# Altium schematic sheet [02] - TRICOLOR LEDS.SchDoc
size A
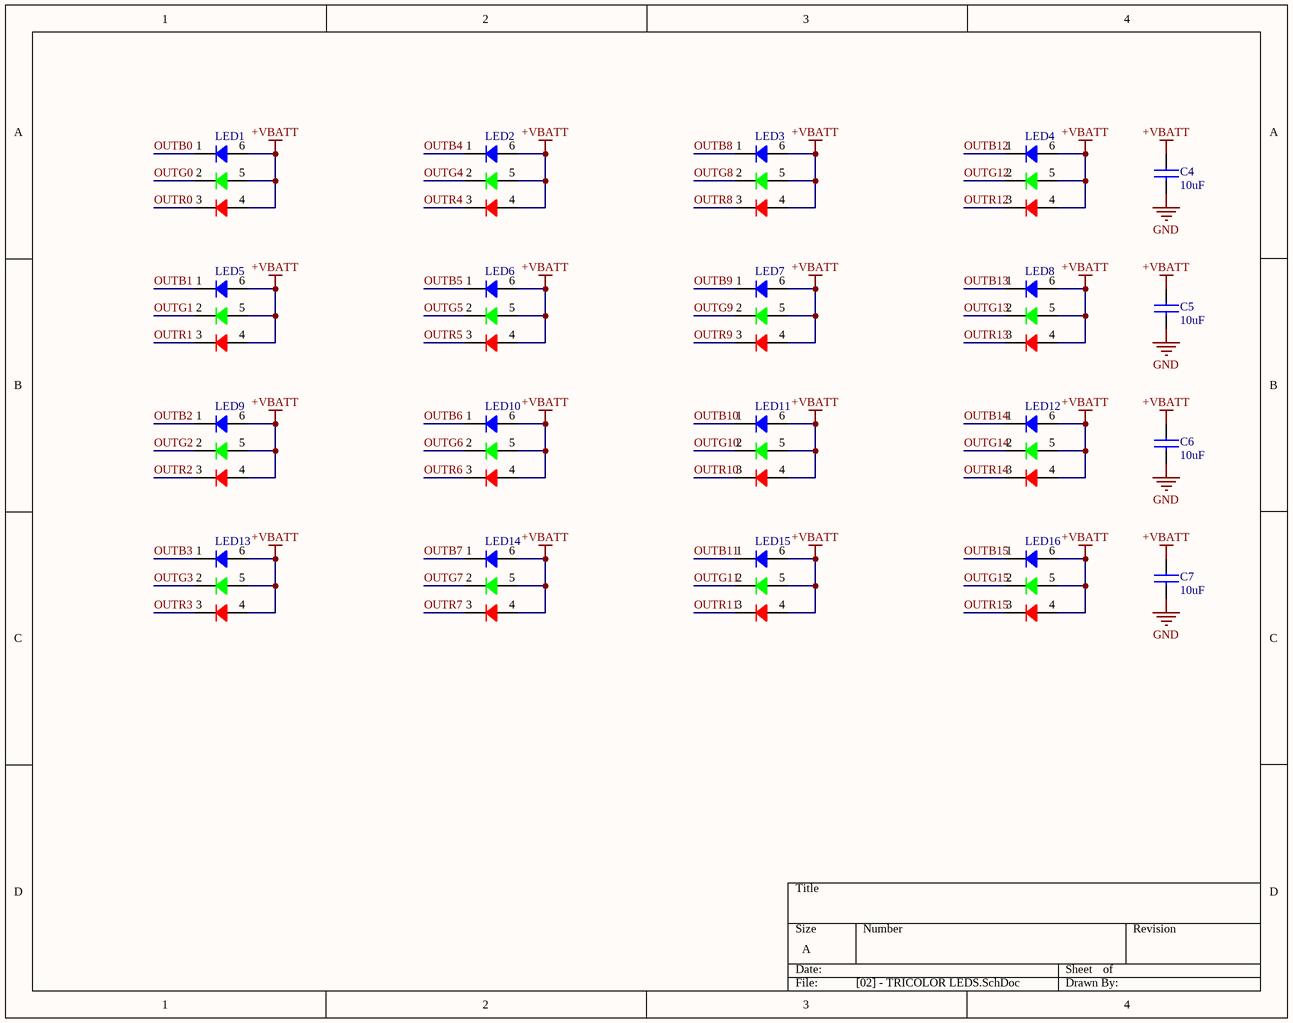
[diagram p0: [02] - TRICOLOR LEDS.SchDoc]

## Parts
C4  10uF  [C0603]
C5  10uF  [C0603]
C6  10uF  [C0603]
C7  10uF  [C0603]
LED1  SLV6A-FKB-CK1P1G1BB7R3R3  [CREE SLV6A-FKB]  (value not drawn)
LED2  SLV6A-FKB-CK1P1G1BB7R3R3  [CREE SLV6A-FKB]  (value not drawn)
LED3  SLV6A-FKB-CK1P1G1BB7R3R3  [CREE SLV6A-FKB]  (value not drawn)
LED4  SLV6A-FKB-CK1P1G1BB7R3R3  [CREE SLV6A-FKB]  (value not drawn)
LED5  SLV6A-FKB-CK1P1G1BB7R3R3  [CREE SLV6A-FKB]  (value not drawn)
LED6  SLV6A-FKB-CK1P1G1BB7R3R3  [CREE SLV6A-FKB]  (value not drawn)
LED7  SLV6A-FKB-CK1P1G1BB7R3R3  [CREE SLV6A-FKB]  (value not drawn)
LED8  SLV6A-FKB-CK1P1G1BB7R3R3  [CREE SLV6A-FKB]  (value not drawn)
LED9  SLV6A-FKB-CK1P1G1BB7R3R3  [CREE SLV6A-FKB]  (value not drawn)
LED10  SLV6A-FKB-CK1P1G1BB7R3R3  [CREE SLV6A-FKB]  (value not drawn)
LED11  SLV6A-FKB-CK1P1G1BB7R3R3  [CREE SLV6A-FKB]  (value not drawn)
LED12  SLV6A-FKB-CK1P1G1BB7R3R3  [CREE SLV6A-FKB]  (value not drawn)
LED13  SLV6A-FKB-CK1P1G1BB7R3R3  [CREE SLV6A-FKB]  (value not drawn)
LED14  SLV6A-FKB-CK1P1G1BB7R3R3  [CREE SLV6A-FKB]  (value not drawn)
LED15  SLV6A-FKB-CK1P1G1BB7R3R3  [CREE SLV6A-FKB]  (value not drawn)
LED16  SLV6A-FKB-CK1P1G1BB7R3R3  [CREE SLV6A-FKB]  (value not drawn)

## Nets
+VBATT: C4.1 C5.1 C6.1 C7.1 LED1.4 LED1.5 LED1.6 LED2.4 LED2.5 LED2.6 LED3.4 LED3.5 LED3.6 LED4.4 LED4.5 LED4.6 LED5.4 LED5.5 LED5.6 LED6.4 LED6.5 LED6.6 LED7.4 LED7.5 LED7.6 LED8.4 LED8.5 LED8.6 LED9.4 LED9.5 LED9.6 LED10.4 LED10.5 LED10.6 LED11.4 LED11.5 LED11.6 LED12.4 LED12.5 LED12.6 LED13.4 LED13.5 LED13.6 LED14.4 LED14.5 LED14.6 LED15.4 LED15.5 LED15.6 LED16.4 LED16.5 LED16.6
GND: C4.2 C5.2 C6.2 C7.2
OUTB0: LED1.1
OUTB1: LED5.1
OUTB2: LED9.1
OUTB3: LED13.1
OUTB4: LED2.1
OUTB5: LED6.1
OUTB6: LED10.1
OUTB7: LED14.1
OUTB8: LED3.1
OUTB9: LED7.1
OUTB10: LED11.1
OUTB11: LED15.1
OUTB12: LED4.1
OUTB13: LED8.1
OUTB14: LED12.1
OUTB15: LED16.1
OUTG0: LED1.2
OUTG1: LED5.2
OUTG2: LED9.2
OUTG3: LED13.2
OUTG4: LED2.2
OUTG5: LED6.2
OUTG6: LED10.2
OUTG7: LED14.2
OUTG8: LED3.2
OUTG9: LED7.2
OUTG10: LED11.2
OUTG11: LED15.2
OUTG12: LED4.2
OUTG13: LED8.2
OUTG14: LED12.2
OUTG15: LED16.2
OUTR0: LED1.3
OUTR1: LED5.3
OUTR2: LED9.3
OUTR3: LED13.3
OUTR4: LED2.3
OUTR5: LED6.3
OUTR6: LED10.3
OUTR7: LED14.3
OUTR8: LED3.3
OUTR9: LED7.3
OUTR10: LED11.3
OUTR11: LED15.3
OUTR12: LED4.3
OUTR13: LED8.3
OUTR14: LED12.3
OUTR15: LED16.3

## Library data of the parts
C4-C7 = GRM188R61A106KE69D: Cap Ceramic 10uF 10V X5R 10% SMD 0603 85C Paper T/R; Manufacturer: Murata; Supplier 1: Digi-Key; Supplier Part Number 1: 490-10474-1-ND; Manufacturer Part Number 1: GRM188R61A106KE69D; Description 1: Cap Ceramic 10uF 10V X5R 10% SMD 0603 85C Paper T/R; Stock: 40000; Pricing: 1=0.22, 10=0.149, 100=0.0754, 500=0.05158, 1000=0.04563 (USD); Mount: Surface Mount; Case/Package: 0603; Case Code (Metric): 1608; Case Code (Imperial): 0603; Min Operating Temperature: -55°C; Max Operating Temperature: 85°C; Capacitance: 10uF; Tolerance: 10%; Packaging: Tape and Reel; Dielectric: X5R; Voltage Rating: 10V; Voltage: 10V; Voltage Rating (DC): 10V; Length: 1.6mm; Height: 0.8mm; Width: 0.031inch; Thickness: 0.037inch; Depth: 0.8mm; REACH SVHC: No SVHC; Lead Free: Lead Free
LED1-LED16 = SLV6A-FKB-CK1P1G1BB7R3R3: LED RGB 6PLCC SMD; Manufacturer: Cree; Color: Blue,Green,Red; Luminous Intensity: 420mcd; Test Current: 20mA; Dominant Wavelength: 470nm; Forward Voltage: 3.2V; Supplier 1: Digi-Key; Supplier Part Number 1: SLV6A-FKB-CK1P1G1BB7R3R3CT-ND; Manufacturer Part Number: SLV6A-FKB-CK1P1G1BB7R3R3; Stock 1: 101474; Pricing 1: 1=0.42, 10=0.395, 100=0.3648, 1000=0.32631 (USD); Mount: Surface Mount; Case/Package: SMD/SMT; Packaging: Tape and Reel; Length: 5.5mm; Height: 2.6mm; Width: 5.3mm